# Altium schematic sheet USB.SchDoc
size A4; SheetNumber: 3; SheetTotal: 14
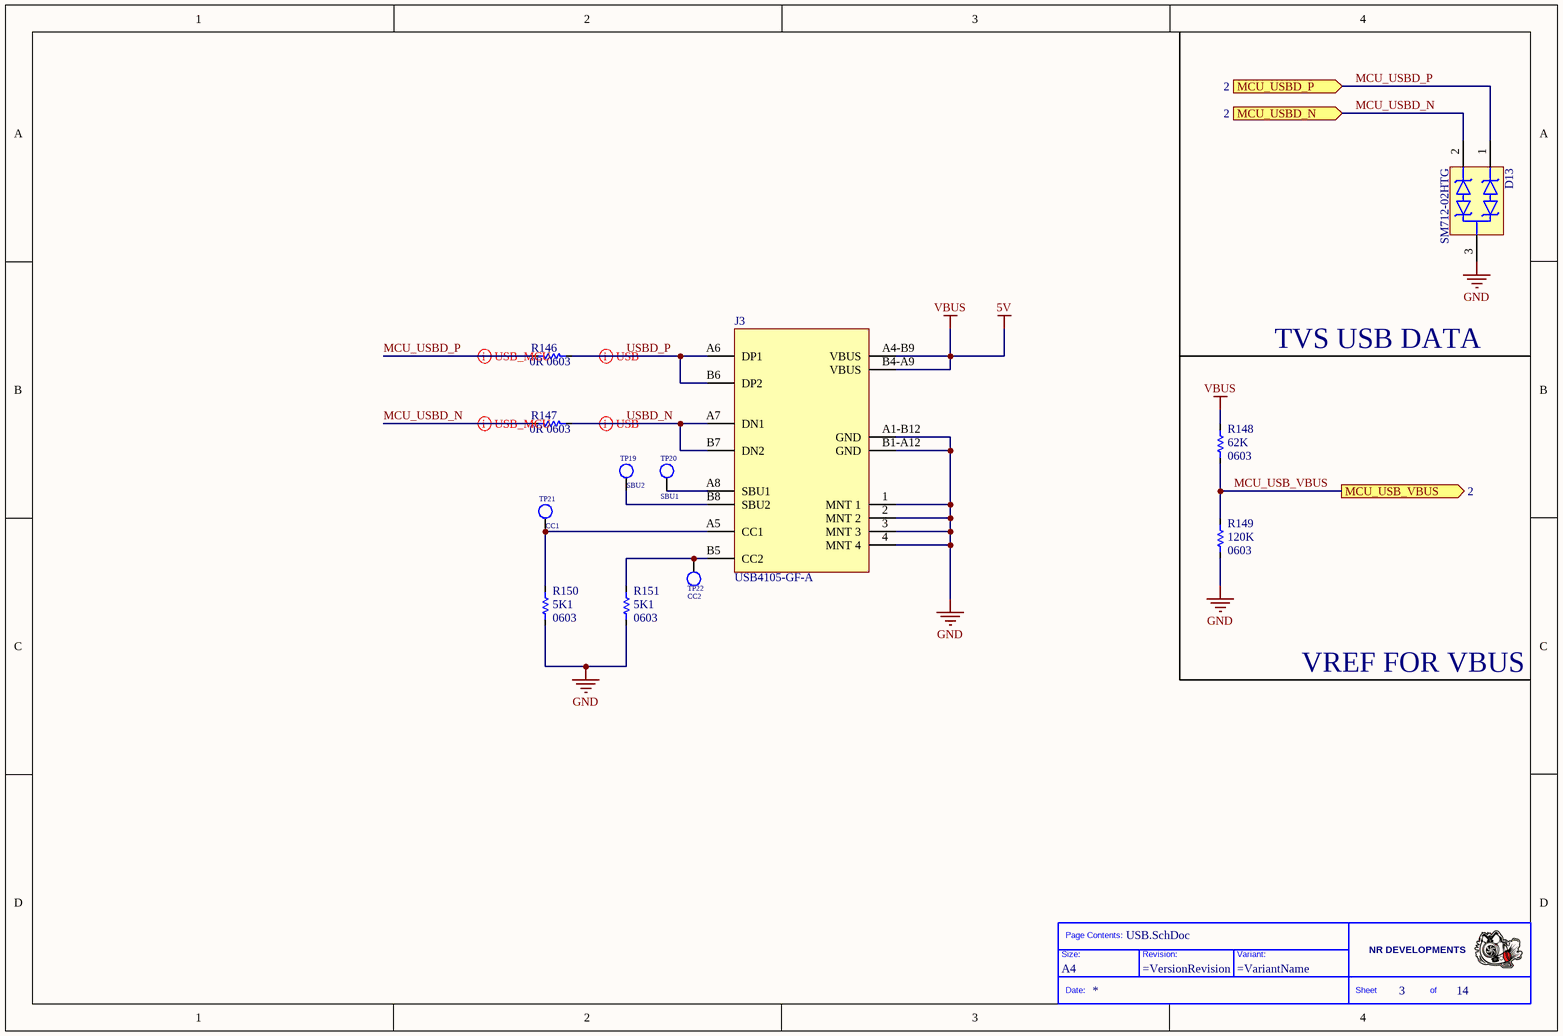
[diagram p0: USB.SchDoc]

## Parts
*  Size: A4  (hidden comment: Title_Block)  (graphical)
D13  SM712-02HTG  [SOT95P240X120-3N]
J3  USB4105-GF-A  [GCT-USB4105-GF-A]
R146  value 0R  Case: 0603  [RESC1608X06M]  (hidden comment: CRCW06030000Z0EAC)
R147  value 0R  Case: 0603  [RESC1608X06M]  (hidden comment: CRCW06030000Z0EAC)
R148  value 62K  Case: 0603  [RESC1608X06M]
R149  value 120K  Case: 0603  [RESC1608X06M]
R150  value 5K1  Case: 0603  [RESC1608X06M]  (hidden comment: Resistor)
R151  value 5K1  Case: 0603  [RESC1608X06M]  (hidden comment: Resistor)
TP19  SBU2  [TP_c200]
TP20  SBU1  [TP_c200]
TP21  CC1  [TP_c200]
TP22  CC2  [TP_c200]

## Ports
MCU_USB_VBUS (out, see 2), MCU_USBD_N (in, see 2), MCU_USBD_P (in, see 2)

## Nets
5V: J3.A4-B9(VBUS) J3.B4-A9(VBUS) R148.2  [also labelled VBUS]
GND: D13.3 J3.1(MNT_1) J3.2(MNT_2) J3.3(MNT_3) J3.4(MNT_4) J3.A1-B12(GND) J3.B1-A12(GND) R149.1 R150.1 R151.1
MCU_USB_VBUS: R148.1 R149.2 ; port MCU_USB_VBUS
MCU_USBD_N: D13.2 R147.1 ; port MCU_USBD_N
MCU_USBD_P: D13.1 R146.1 ; port MCU_USBD_P
USBD_N: J3.A7(DN1) J3.B7(DN2) R147.2
USBD_P: J3.A6(DP1) J3.B6(DP2) R146.2
NetJ3_A5: J3.A5(CC1) R150.2 TP21.1
NetJ3_A8: J3.A8(SBU1) TP20.1
NetJ3_B5: J3.B5(CC2) R151.2 TP22.1
NetJ3_B8: J3.B8(SBU2) TP19.1

## Layout directives
differential pair: MCU_USBD_N, MCU_USBD_P, USBD_N, USBD_P

## Notes on the sheet
- TVS USB DATA
- VREF FOR VBUS
- (in symbol Title_Block) Page Contents:; NR DEVELOPMENTS; Size:; Revision:; Variant:; Date:; Sheet; of

## Library data of the parts
D13 = SM712-02HTG: ESD Diode bid -7 to 12v; Manufacturer: Littelfuse; PartNumber: SM712-02HTG; Case: SOT23-3; Value: SM712-02HTG
J3 = USB4105-GF-A: USB Connectors USB Type C,2.0, Rec,SMT, 0.95mmTH Shell Stakes,G/F,RA,Top Mnt,T&R; Manufacturer: GCT; PartNumber: USB4105-GF-A; Value: USB4105-GF-A; Case: USB-C
R146 R147 = Resistor: Manufacturer: YAGEO; PartNumber: RC0603JR-070RL
R148-R151 = Resistor: Manufacturer: Vishay; PartNumber: CRCW06035K10FKEC
TP19-TP22 = Test_Point: Test Poin